# EAGLE design simhid-g1000_bottom (EAGLE 9.6.2)
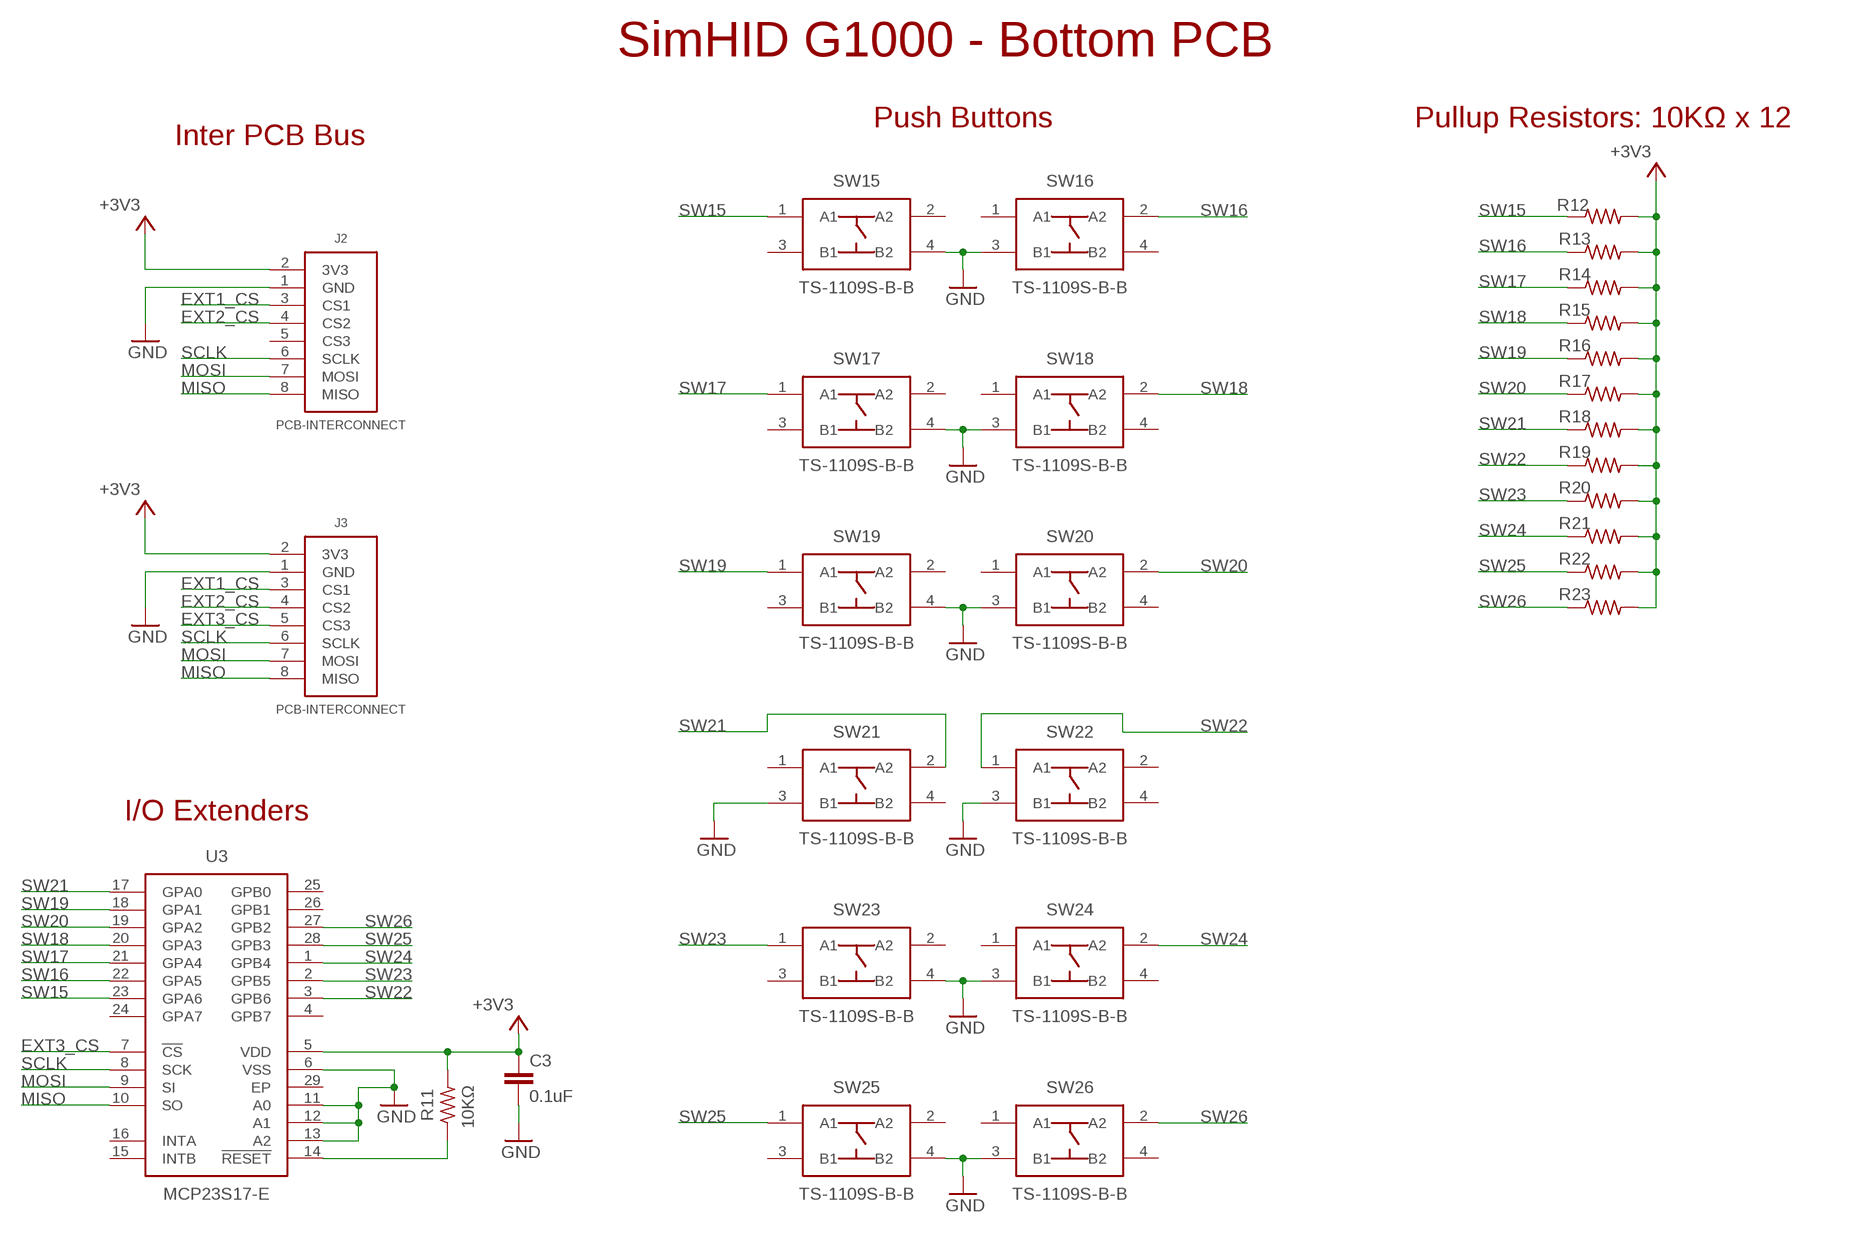
[diagram p0: schematic, sheet 1]

## Parts
C3  0.1uF  RCL_C-EUC0402-HS  [RCL_C0402_HS]
J2  PCB-INTERCONNECT  [PCB-INTERCONNECT]
J3  PCB-INTERCONNECT  [PCB-INTERCONNECT]
R11  10KΩ  RCL_R-US_R0402-HS  [RCL_R0402_HS]
R12  RCL_R-US_R0402-HS  [RCL_R0402_HS]
R13  RCL_R-US_R0402-HS  [RCL_R0402_HS]
R14  RCL_R-US_R0402-HS  [RCL_R0402_HS]
R15  RCL_R-US_R0402-HS  [RCL_R0402_HS]
R16  RCL_R-US_R0402-HS  [RCL_R0402_HS]
R17  RCL_R-US_R0402-HS  [RCL_R0402_HS]
R18  RCL_R-US_R0402-HS  [RCL_R0402_HS]
R19  RCL_R-US_R0402-HS  [RCL_R0402_HS]
R20  RCL_R-US_R0402-HS  [RCL_R0402_HS]
R21  RCL_R-US_R0402-HS  [RCL_R0402_HS]
R22  RCL_R-US_R0402-HS  [RCL_R0402_HS]
R23  RCL_R-US_R0402-HS  [RCL_R0402_HS]
SW15  TS-1109S-B-B  [TS-1109S-B-B]
SW16  TS-1109S-B-B  [TS-1109S-B-B]
SW17  TS-1109S-B-B  [TS-1109S-B-B]
SW18  TS-1109S-B-B  [TS-1109S-B-B]
SW19  TS-1109S-B-B  [TS-1109S-B-B]
SW20  TS-1109S-B-B  [TS-1109S-B-B]
SW21  TS-1109S-B-B  [TS-1109S-B-B]
SW22  TS-1109S-B-B  [TS-1109S-B-B]
SW23  TS-1109S-B-B  [TS-1109S-B-B]
SW24  TS-1109S-B-B  [TS-1109S-B-B]
SW25  TS-1109S-B-B  [TS-1109S-B-B]
SW26  TS-1109S-B-B  [TS-1109S-B-B]
U3  MCP23S17-E  MCP23S17-E_ML  [QFN65P600X600X100-29N]

## Nets
+3V3: C3.1 J2.2(3V3) J3.2(3V3) R11.2 R12.2 R13.2 R14.2 R15.2 R16.2 R17.2 R18.2 R19.2 R20.2 R21.2 R22.2 R23.2 U3.5(VDD)
EXT1_CS: J2.3(CS1) J3.3(CS1)
EXT2_CS: J2.4(CS2) J3.4(CS2)
EXT3_CS: J3.5(CS3) U3.7(!CS)
GND: C3.2 J2.1(GND) J3.1(GND) SW15.4(B2) SW16.3(B1) SW17.4(B2) SW18.3(B1) SW19.4(B2) SW20.3(B1) SW21.3(B1) SW22.3(B1) SW23.4(B2) SW24.3(B1) SW25.4(B2) SW26.3(B1) U3.6(VSS) U3.11(A0) U3.12(A1) U3.13(A2)
MISO: J2.8(MISO) J3.8(MISO) U3.10(SO)
MOSI: J2.7(MOSI) J3.7(MOSI) U3.9(SI)
RESET: R11.1 U3.14(!RESET)
SCLK: J2.6(SCLK) J3.6(SCLK) U3.8(SCK)
SW15: R12.1 SW15.1(A1) U3.23(GPA6)
SW16: R13.1 SW16.2(A2) U3.22(GPA5)
SW17: R14.1 SW17.1(A1) U3.21(GPA4)
SW18: R15.1 SW18.2(A2) U3.20(GPA3)
SW19: R16.1 SW19.1(A1) U3.18(GPA1)
SW20: R17.1 SW20.2(A2) U3.19(GPA2)
SW21: R18.1 SW21.2(A2) U3.17(GPA0)
SW22: R19.1 SW22.1(A1) U3.3(GPB6)
SW23: R20.1 SW23.1(A1) U3.2(GPB5)
SW24: R21.1 SW24.2(A2) U3.1(GPB4)
SW25: R22.1 SW25.1(A1) U3.28(GPB3)
SW26: R23.1 SW26.2(A2) U3.27(GPB2)
Unconnected: J2.5(CS3) SW15.2(A2) SW15.3(B1) SW16.1(A1) SW16.4(B2) SW17.2(A2) SW17.3(B1) SW18.1(A1) SW18.4(B2) SW19.2(A2) SW19.3(B1) SW20.1(A1) SW20.4(B2) SW21.1(A1) SW21.4(B2) SW22.2(A2) SW22.4(B2) SW23.2(A2) SW23.3(B1) SW24.1(A1) SW24.4(B2) SW25.2(A2) SW25.3(B1) SW26.1(A1) SW26.4(B2) U3.4(GPB7) U3.15(INTB) U3.16(INTA) U3.24(GPA7) U3.25(GPB0) U3.26(GPB1) U3.29(EP)

## Notes on the sheet
- SimHID G1000 - Bottom PCB
- Push Buttons | Pullup Resistors: 10KΩ x 12
- Inter PCB Bus
- I/O Extenders

## Library data of the parts
C3 = gen-discrete3:RCL_C-EU: CAPACITOR, European symbol
J2 J3 = SimHID-G1000:PCB-INTERCONNECT
R11-R23 = gen-discrete3:RCL_R-US_: RESISTOR, American symbol
SW15-SW26 = Switches:TS-1109S-B-B
U3 = MCP23S17-E_ML:MCP23S17-E_ML: 16-Bit I/O Port Expander SPI 10M QFN28EP Microchip MCP23S17-E/ML, 16-channel 16bit I/O Expander 10MHz, Serial-SPI, 28-Pin QFN Source: Datasheet <http://docs-emea.rs-online.com/webdocs/1169/0900766b811692f9.pdf>; ARROW_PART_NUMBER: MCP23S17-E/ML; ARROW_PRICE-STOCK: https://www.arrow.com/en/products/mcp23s17-eml/microchip-technology; DESCRIPTION: 16-Bit I/O Port Expander SPI 10M QFN28EP Microchip MCP23S17-E/ML, 16-channel 16bit I/O Expander 10MHz, Serial-SPI, 28-Pin QFN; HEIGHT: 1mm; MANUFACTURER_NAME: Microchip; MANUFACTURER_PART_NUMBER: MCP23S17-E/ML; MOUSER_PART_NUMBER: 579-MCP23S17-E/ML; MOUSER_PRICE-STOCK: https://www.mouser.co.uk/ProductDetail/Microchip-Technology/MCP23S17-E-ML/?qs=usxtMOJb1RyqBjk32jXtPQ%3D%3D

## Board
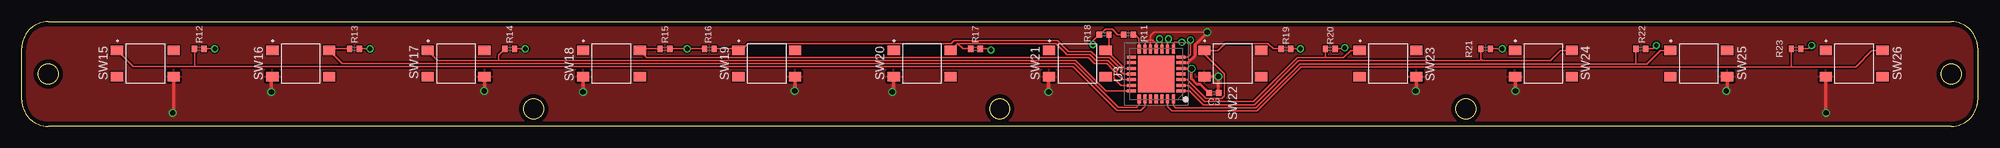
[diagram p1: board, top side]
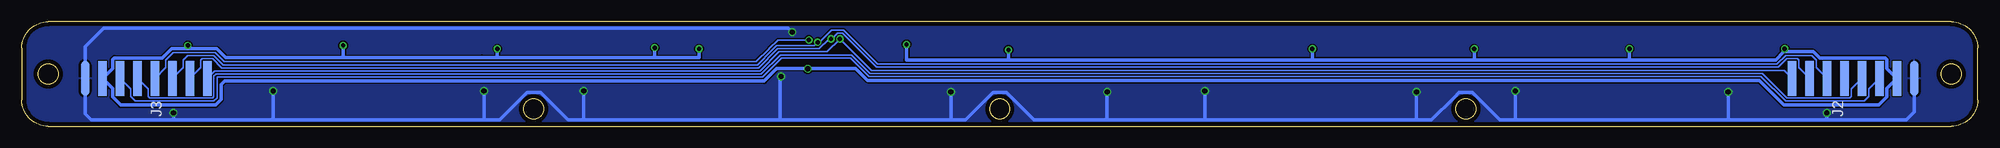
[diagram p2: board, bottom side, seen from below]

Size 224 x 12 mm. Coordinates in mm from the lower left corner, seen from the top.
Outline: 3,12 arc90 0,9 0,3 arc90 3,0 221,0 arc90 224,3 224,9 arc90 221,12 3,12
Outline: circle at 58.63,2 radius 1.15
Outline: circle at 3,6 radius 1.15
Outline: circle at 165.37,2 radius 1.15
Outline: circle at 221,6 radius 1.15
Outline: circle at 112,2 radius 1.15
Copper layers (1*16): Top 0.035mm / dielectric 1mm / Bottom 0.035mm
Design rules "Elecrow_2-layer_PCB_eagle_rule *": minimum track width 6mil, minimum drill 12mil, track to track 6mil, track to pad 6mil, pad to pad 6mil, via to via 8mil, smd to smd 0mil, copper to edge 20mil, drill to drill 10mil, minimum pad ring 6mil, minimum via ring 6mil, stop-mask expansion 0mil, vias tented up to drill 100mil, thermal gap 10mil
Holes 2.3 mm at 3,6 58.63,2 112,2 165.37,2 221,6

### Footprints (pad centres in the part's own frame; a part is rotated, then mirrored left to right if it is on the bottom)
RCL_C0402_HS = smd 0.6 x 0.7: 1 -0.55,0; 2 0.55,0
PCB-INTERCONNECT = smd 1 x 4: 1 -7,0; 2 -5,0; 3 -3,0; 4 -1,0; 5 1,0; 6 3,0; 7 5,0; 8 7,0
RCL_R0402_HS = smd 0.6 x 0.7: 1 -0.55,0; 2 0.55,0
TS-1109S-B-B = smd 1.4 x 1.1: 1 -3.25,1.5; 2 3.25,1.5; 3 -3.25,-1.5; 4 3.25,-1.5
QFN65P600X600X100-29N = smd 1.05 x 0.35: 1 -2.85,1.95; 2 -2.85,1.3; 3 -2.85,0.65; 4 -2.85,0; 5 -2.85,-0.65; 6 -2.85,-1.3; 7 -2.85,-1.95; 15 2.85,-1.95; 16 2.85,-1.3; 17 2.85,-0.65; 18 2.85,0; 19 2.85,0.65; 20 2.85,1.3; 21 2.85,1.95 | smd 0.35 x 1.05: 8 -1.95,-2.85; 9 -1.3,-2.85; 10 -0.65,-2.85; 11 0,-2.85; 12 0.65,-2.85; 13 1.3,-2.85; 14 1.95,-2.85; 22 1.95,2.85; 23 1.3,2.85; 24 0.65,2.85; 25 0,2.85; 26 -0.65,2.85; 27 -1.3,2.85; 28 -1.95,2.85 | smd 4.2 x 4.2: 29 0,0

### Placement (x,y rotation side)
C3  136.53,3.81 0 top
J2  14.25,5.5 180 bottom
J3  209.75,5.5 0 bottom
R11  126.75,10.54 180 top
R12  20.32,8.89 0 top
R13  38.1,8.89 0 top
R14  55.88,8.89 0 top
R15  73.66,8.89 0 top
R16  78.74,8.89 180 top
R17  109.22,8.89 0 top
R18  123.95,10.54 180 top
R19  144.78,8.89 0 top
R20  149.86,8.89 0 top
R21  167.64,8.89 0 top
R22  185.42,8.89 0 top
R23  203.2,8.89 0 top
SW15  14.15,7.2 0 top
SW16  31.95,7.2 0 top
SW17  49.73,7.2 0 top
SW18  67.53,7.2 0 top
SW19  85.31,7.2 0 top
SW20  103.11,7.2 0 top
SW21  120.89,7.2 0 top
SW22  138.69,7.2 0 top
SW23  156.47,7.2 0 top
SW24  174.26,7.2 0 top
SW25  192.06,7.2 0 top
SW26  209.84,7.2 0 top
U3  129.92,6 180 top

### Tracks (layer width: path | path; a pad name or v marks a point on that pad's centre or on a via)
+3V3  (via drill 0.5, 0.6)
  Top 0.2: v204.98,9.27 204.6,8.89 R23.2 | v187.2,9.27 186.82,8.89 R22.2 | R21.2 v169.54,8.89 | v151.51,9.02 151.38,8.89 R20.2 | R19.2 v146.43,8.89 | v122.68,9.4 122.68,9.82 R18.2 123.5,10.54 124.1,11.14 124.91,11.14 125.51,10.54 R11.2 | R17.2 110.87,8.89 v111,8.76 | R15.2 v76.2,8.89 R16.2 | R14.2 v57.66,8.89 | R13.2 v39.88,8.89 | R12.2 v22.1,8.89
  Top 0.35: U3.5 133.94,6.65 | 133.94,6.65 v133.99,6.6 | C3.1 134.96,4.82 134.6,4.82 133.94,5.48 133.94,6.65
  Bottom 0.4: 187.2,7.89 200.65,7.89 201.67,8.91 204.62,8.91 | 187.2,7.89 171.34,7.89 171.32,7.87 169.54,7.87 | 204.62,8.91 206.84,8.91 207.89,7.85 213.4,7.85 213.6,7.65 213.6,6.65 J3.2 213.6,4.35 213.6,3.35 212.69,2.44 201.81,2.44 201.19,3.06 201.19,4.79 200.79,5.19 138.99,5.19 137.58,6.6 v133.99,6.6 128.51,6.6 127.17,5.26 25.01,5.26 22.19,2.44 11.31,2.44 10.4,3.35 10.4,4.35 J2.2 10.4,6.65 10.4,7.65 10.6,7.85 18.11,7.85 18.81,8.56 21.84,8.56 | 169.54,7.87 151.51,7.87 | 151.51,7.87 146.43,7.87 v146.43,8.89 | 21.84,8.56 22.19,8.56 23.12,7.62 40.01,7.62 | 40.01,7.62 57.78,7.62 | 57.78,7.62 76.2,7.62 | 76.2,7.62 111,7.62 | 111,7.62 122.68,7.62 v122.68,9.4 | v204.98,9.27 204.62,8.91 | v169.54,8.89 169.54,7.87 | v151.51,9.02 151.51,7.87 | v111,8.76 111,7.62 | v76.2,8.89 76.2,7.62 | v57.66,8.89 57.66,7.75 57.78,7.62 | v39.88,8.89 39.88,7.75 40.01,7.62 | v22.1,8.89 22.1,8.81 21.84,8.56 | v187.2,9.27 187.2,7.89
EXT1_CS
  Bottom 0.2: J3.3 211.5,4.25 211.5,3.4 211,2.9 202,2.9 201.65,3.25 201.65,5.61 201.61,5.64 139.18,5.64 136.98,7.84 129.11,7.84 126.98,5.71 24.82,5.71 22,2.9 13,2.9 12.5,3.4 12.5,4.25 J2.3
EXT2_CS
  Bottom 0.2: J3.4 209.5,4.25 209.5,3.4 209.35,3.25 202.15,3.25 202,3.4 202,5.75 201.75,6 139.32,6 137.13,8.19 128.96,8.19 126.83,6.07 24.67,6.07 21.86,3.25 14.64,3.25 14.5,3.4 14.5,4.25 J2.4
EXT3_CS  (via drill 0.5)
  Top 0.2: U3.7 133.55,7.95 133.86,8.26 v133.86,9.91
  Bottom 0.2: J3.5 207.5,6.75 207.5,7.61 206.65,8.46 201.85,8.46 200.84,7.44 171.53,7.44 171.49,7.41 139.91,7.41 138.43,8.88 138.43,8.89 137.41,9.91 v133.86,9.91
GND  (via drill 0.6)
  Top 0.2: U3.12 129.27,9.91 | 129.27,9.91 129.27,10.4 129.67,10.79 v135.76,10.79 | U3.11 129.92,9.49 129.5,9.91 129.27,9.91 | U3.13 128.62,9.49 129.03,9.91 129.27,9.91
  Top 0.35: U3.6 133.58,7.3 134.41,8.13 134.41,9.39 135.76,10.74 v135.76,10.79 | C3.2 137.07,5.64 137.02,5.7
  Top 0.4: SW26.3 206.59,1.56 v206.63,1.52 | SW25.4 195.31,4.17 v195.2,4.06 | SW24.3 171.07,5.65 v171.07,4.06 | SW23.4 159.72,4.15 v159.64,4.06 | SW20.3 99.86,4.1 v99.69,3.94 | SW19.4 88.56,4.11 v88.52,4.06 | SW18.3 64.28,3.95 v64.26,3.94 | SW17.4 52.98,4.09 v52.96,4.06 | SW16.3 28.57,5.58 v28.57,3.94 | SW15.4 17.41,1.66 v17.27,1.52 | SW22.3 137.02,5.7 v137.03,5.71 | v117.6,3.94 117.6,5.66 SW21.3
  Bottom 0.4: J2.1 7.25,1.64 8.18,0.71 17.53,0.71 | 206.88,0.71 216.03,0.71 216.75,1.43 J3.1 216.75,9.17 214.63,11.29 136.26,11.29 v135.76,10.79 | 206.88,0.71 195.45,0.71 | 195.45,0.71 171.07,0.71 | 171.07,0.71 169.3,0.71 166.15,3.86 164.59,3.86 161.44,0.71 159.51,0.71 | 159.51,0.71 137.16,0.71 | 137.16,0.71 117.47,0.71 | 117.47,0.71 115.93,0.71 112.78,3.86 111.22,3.86 108.07,0.71 99.95,0.71 | 99.95,0.71 88.52,0.71 | 88.52,0.71 64.39,0.71 | 64.39,0.71 62.55,0.71 60,3.26 59.95,3.32 59.89,3.37 59.4,3.86 57.85,3.86 54.7,0.71 52.96,0.71 | 52.96,0.71 28.57,0.71 | 28.57,0.71 17.53,0.71 | v195.2,4.06 195.2,0.96 195.45,0.71 | v171.07,4.06 171.07,0.71 | v159.64,4.06 159.64,0.83 159.51,0.71 | v99.69,3.94 99.69,0.96 99.95,0.71 | v88.52,4.06 88.52,0.71 | v64.26,3.94 64.26,0.83 64.39,0.71 | v52.96,4.06 52.96,0.71 | v28.57,3.94 28.57,0.71 | v17.27,1.52 17.27,0.96 17.53,0.71 | v206.63,1.52 206.63,0.96 206.88,0.71 | v137.03,5.71 137.16,5.59 137.16,0.71 | v117.6,3.94 117.6,0.83 117.47,0.71
  pour Top: 0,0 0,12.7 2.54,12.7 224.79,12.7 224.79,0
  pour Bottom: 0,-1.27 -0.76,-1.27 -0.76,13.34 225.68,13.34 225.68,4.7 225.68,-1.27
MISO  (via drill 0.5)
  Top 0.2: U3.10 130.57,9.76 v130.3,10.03
  Bottom 0.2: J3.8 201.9,6.35 139.47,6.35 137.27,8.55 131.79,8.55 v130.3,10.03 126.69,6.42 22.17,6.42 J2.8
MOSI  (via drill 0.5)
  Top 0.2: U3.9 131.22,9.94 v131.32,10.03
  Bottom 0.2: J3.7 203.5,6.75 203.5,7.61 203.35,7.75 202.15,7.75 201.09,6.7 143.51,6.7 139.62,6.7 137.42,8.9 132.67,8.9 131.53,10.03 v131.32,10.03 131.23,10.03 130.57,10.69 130.03,10.69 126.11,6.77 22.84,6.77 21.86,7.75 20.64,7.75 20.5,7.61 20.5,6.75 J2.7
RESET
  Top 0.2: U3.14 127.97,10.08 127.51,10.54 R11.1
SCLK  (via drill 0.5)
  Top 0.2: U3.8 131.87,9.44 132.08,9.65 v132.84,9.65
  Bottom 0.2: J3.6 205.5,6.75 205.5,7.61 205,8.11 202,8.11 200.95,7.05 143.51,7.05 139.76,7.05 138.08,8.74 137.57,9.25 133.24,9.25 v132.84,9.65 132.62,9.65 131.24,11.04 129.88,11.04 125.97,7.12 22.98,7.12 22,8.11 19,8.11 18.5,7.61 18.5,6.75 J2.6
SW15
  Top 0.2: 19.81,6.84 12.77,6.84 SW15.1 | R12.1 19.81,8.85 19.81,6.84 | U3.23 128.62,2.26 128.17,1.81 125.44,1.81 120.4,6.84 19.81,6.84
SW16
  Top 0.2: 35.28,8.61 36.7,7.19 120.55,7.19 125.58,2.16 127.64,2.16 127.97,2.5 U3.22 | 35.28,8.61 SW16.2 | R13.1 35.56,8.89 35.28,8.61
SW17
  Top 0.2: 54.61,7.54 118.11,7.54 118.21,7.54 120.69,7.54 124.19,4.05 U3.21 | 54.61,7.54 47.64,7.54 SW17.1 | R14.1 54.61,8.17 54.61,7.54
SW18
  Top 0.2: R15.1 70.97,8.89 SW18.2 71.58,7.9 122.17,7.9 122.87,7.19 124.26,7.19 125.1,6.36 125.1,5.46 125.86,4.7 U3.20
SW19
  Top 0.2: R16.1 81.88,8.89 SW19.1 82.21,8.55 83.16,9.5 106.4,9.5 106.76,9.86 118.6,9.86 119.85,8.6 122.46,8.6 123.17,7.9 124.55,7.9 125.8,6.65 125.8,6.35 126.15,6 U3.18
SW20
  Top 0.2: SW20.2 107.16,9.5 | 107.16,9.5 118.45,9.5 119.7,8.25 122.32,8.25 123.02,7.54 124.41,7.54 125.45,6.5 125.45,5.97 126.07,5.35 U3.19 | 107.16,9.5 107.77,8.89 R17.1
SW21
  Top 0.2: R18.1 124.5,9.06 124.27,8.82 SW21.2 124.59,8.25 124.7,8.25 126.3,6.65 U3.17
SW22
  Top 0.2: R19.1 143.35,8.89 142.74,9.5 137.77,9.5 136.97,8.7 SW22.1 135.44,8.31 137.74,6.01 137.74,3.47 137.45,3.17 135.6,3.17 135.42,3.35 135.42,3.39 133.46,5.35 U3.3
SW23
  Top 0.2: SW23.1 152.21,8.7 151.38,7.87 149.35,7.87 | R20.1 149.31,7.92 149.35,7.87 | 149.35,7.87 146.08,7.87 141.03,2.82 135.46,2.82 134.34,3.94 134.34,3.97 133.6,4.7 U3.2
SW24
  Top 0.2: SW24.2 176.21,8.7 175.03,7.52 167.26,7.52 | R21.1 167.09,7.69 167.26,7.52 | 167.26,7.52 146.22,7.52 141.17,2.47 135.31,2.47 133.73,4.05 U3.1
SW25
  Top 0.2: SW25.1 187.64,8.7 186.11,7.17 184.91,7.17 | R22.1 184.87,7.21 184.91,7.17 | 184.91,7.17 146.37,7.17 141.32,2.12 132.12,2.12 131.87,2.37 U3.28
SW26
  Top 0.2: SW26.2 211.9,8.7 210.02,6.82 202.69,6.82 202.65,6.86 | R23.1 202.65,6.86 | 202.65,6.86 202.61,6.82 146.52,6.82 141.47,1.76 131.71,1.76 131.22,2.26 U3.27